# EAGLE schematic blinker (EAGLE 9.6.2)
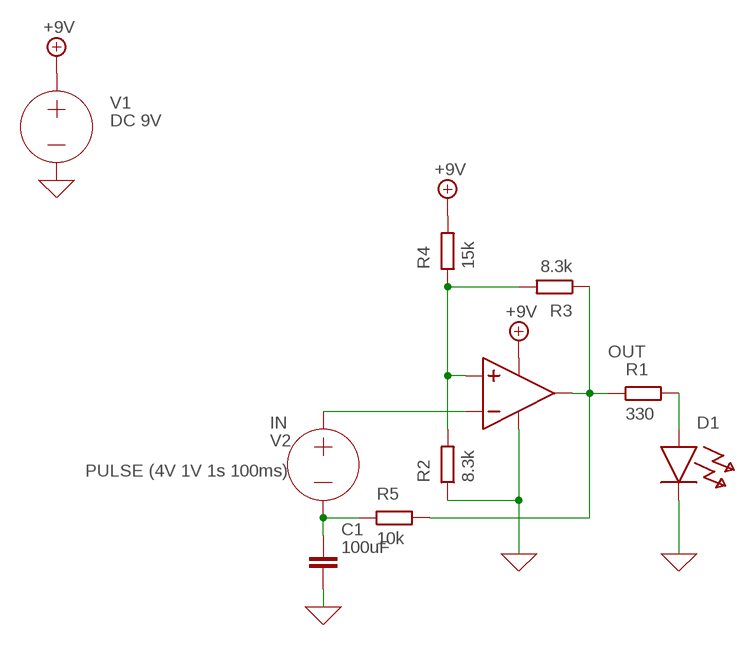
[diagram p0: schematic, sheet 1]

## Parts
C1  100uF  C  (no package)
D1  LED  (no package)
R1  330  R  (no package)
R2  8.3k  R  (no package)
R3  8.3k  R  (no package)
R4  15k  R  (no package)
R5  10k  R  (no package)
U$1  LM358DIP8  [DIP8]
V1  DC 9V  VOLTAGE  (no package)
V2  PULSE (4V 1V 1s 100ms)  VOLTAGE  (no package)

## Nets
0: C1.2 D1.C R2.1 U$1.8(VSS) V1.- ; supply symbol labelled GND
+9V: R4.2 U$1.4(VDD) V1.+
IN: U$1.2(INV) V2.+
N$1: C1.1 R5.1 V2.-
N$4: D1.A R1.2
OUT: R1.1 R3.1 R5.2 U$1.1(OUT)
REF: R2.2 R3.2 R4.1 U$1.3(NONINV)

## Library data of the parts
C1 = ngspice-simulation:C: CAPACITOR
D1 = ngspice-simulation:LED: Diode
R1-R5 = ngspice-simulation:R: RESISTOR
U$1 = DWD_Educational_parts:LM358; SPICEMODEL: LM358; SPICEPREFIX: X
V1 V2 = ngspice-simulation:VOLTAGE: Independent Voltage Source, either DC, AC, PULSE, SINE, PWL, EXP, or SFFM; VALUE: 0V